# EAGLE design untitledv1.0 (EAGLE 9.6.2)
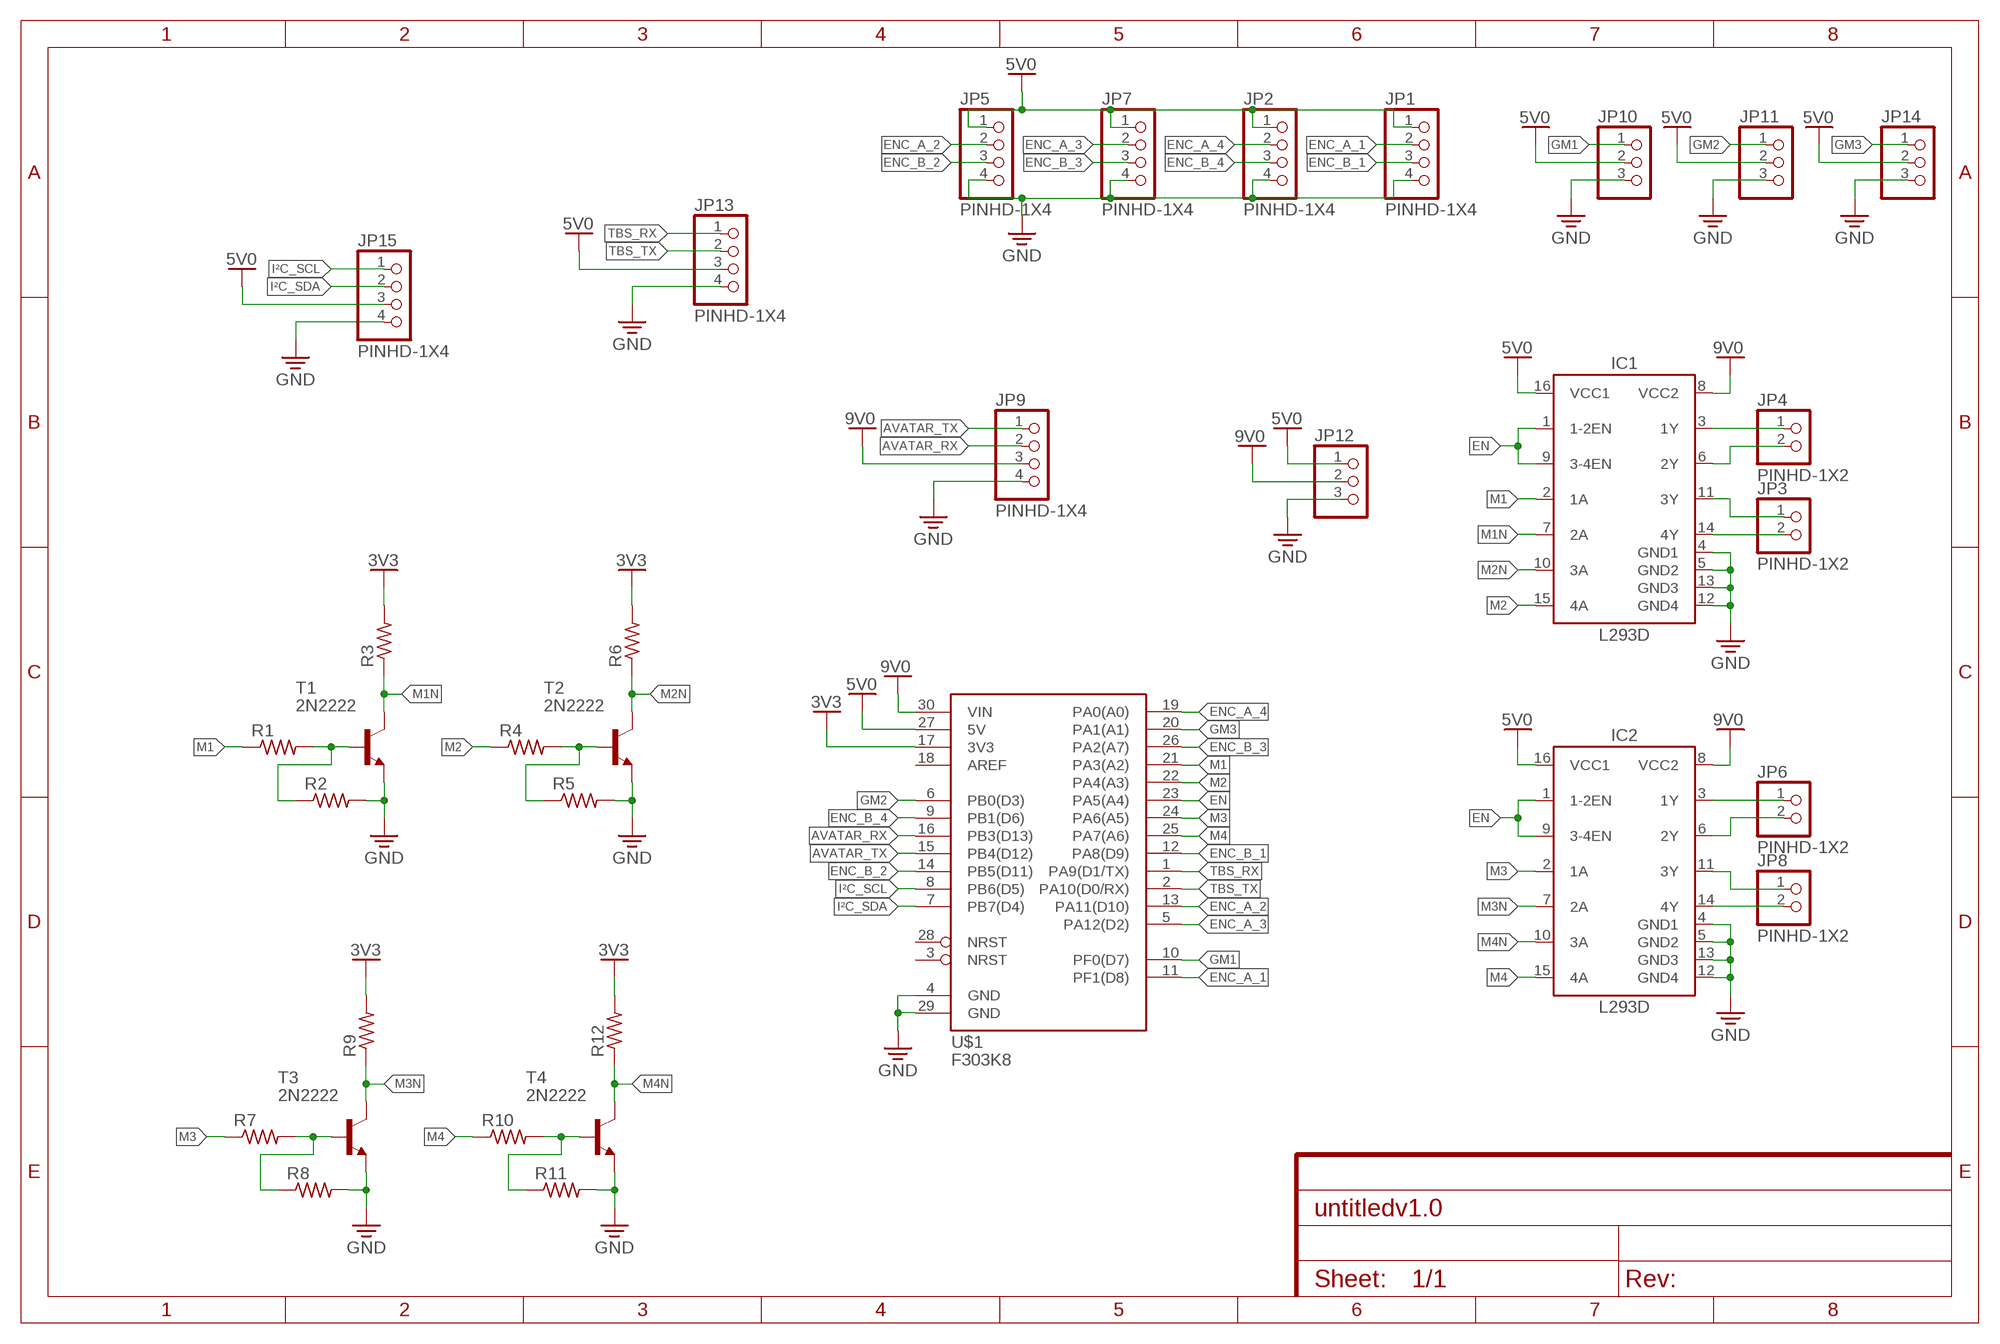
[diagram p0: schematic, sheet 1]

## Parts
IC1  L293D  [DIP762W53P254L1969H508Q16B]
IC2  L293D  [DIP762W53P254L1969H508Q16B]
JP1  PINHD-1X4  [1X04]
JP2  PINHD-1X4  [1X04]
JP3  PINHD-1X2  [1X02]
JP4  PINHD-1X2  [1X02]
JP5  PINHD-1X4  [1X04]
JP6  PINHD-1X2  [1X02]
JP7  PINHD-1X4  [1X04]
JP8  PINHD-1X2  [1X02]
JP9  PINHD-1X4  [1X04]
JP10  PINHD-1X3  [1X03]
JP11  PINHD-1X3  [1X03]
JP12  PINHD-1X3  [1X03]
JP13  PINHD-1X4  [1X04]
JP14  PINHD-1X3  [1X03]
JP15  PINHD-1X4  [1X04]
R1  R-US_0204/2V  [0204V]
R2  R-US_0204/2V  [0204V]
R3  R-US_0204/2V  [0204V]
R4  R-US_0204/2V  [0204V]
R5  R-US_0204/2V  [0204V]
R6  R-US_0204/2V  [0204V]
R7  R-US_0204/2V  [0204V]
R8  R-US_0204/2V  [0204V]
R9  R-US_0204/2V  [0204V]
R10  R-US_0204/2V  [0204V]
R11  R-US_0204/2V  [0204V]
R12  R-US_0204/2V  [0204V]
T1  2N2222  [TO92-EBC-OVAL]
T2  2N2222  [TO92-EBC-OVAL]
T3  2N2222  [TO92-EBC-OVAL]
T4  2N2222  [TO92-EBC-OVAL]
U$1  F303K8  [NUCLEO_F303K8-V2]

## Nets
3V3: R3.2 R6.2 R9.2 R12.2 U$1.17(3V3)
5V0: IC1.16(VCC1) IC2.16(VCC1) JP1.1 JP2.1 JP5.1 JP7.1 JP10.2 JP11.2 JP12.1 JP13.3 JP14.2 JP15.3 U$1.27(5V)
9V0: IC1.8(VCC2) IC2.8(VCC2) JP9.3 JP12.2 U$1.30(VIN)
AVATAR_RX: JP9.2 U$1.16(PB3(D13))
AVATAR_TX: JP9.1 U$1.15(PB4(D12))
EN: IC1.1(1-2EN) IC1.9(3-4EN) IC2.1(1-2EN) IC2.9(3-4EN) U$1.23(PA5(A4))
ENC_A_1: JP1.2 U$1.11(PF1(D8))
ENC_A_2: JP5.2 U$1.13(PA11(D10))
ENC_A_3: JP7.2 U$1.5(PA12(D2))
ENC_A_4: JP2.2 U$1.19(PA0(A0))
ENC_B_1: JP1.3 U$1.12(PA8(D9))
ENC_B_2: JP5.3 U$1.14(PB5(D11))
ENC_B_3: JP7.3 U$1.26(PA2(A7))
ENC_B_4: JP2.3 U$1.9(PB1(D6))
GM1: JP10.1 U$1.10(PF0(D7))
GM2: JP11.1 U$1.6(PB0(D3))
GM3: JP14.1 U$1.20(PA1(A1))
GND: IC1.4(GND1) IC1.5(GND2) IC1.12(GND4) IC1.13(GND3) IC2.4(GND1) IC2.5(GND2) IC2.12(GND4) IC2.13(GND3) JP1.4 JP2.4 JP5.4 JP7.4 JP9.4 JP10.3 JP11.3 JP12.3 JP13.4 JP14.3 JP15.4 R2.2 R5.2 R8.2 R11.2 T1.E T2.E T3.E T4.E U$1.4(GND) U$1.29(GND)
I²C_SCL: JP15.1 U$1.8(PB6(D5))
I²C_SDA: JP15.2 U$1.7(PB7(D4))
M1: IC1.2(1A) R1.1 U$1.21(PA3(A2))
M1N: IC1.7(2A) R3.1 T1.C
M2: IC1.15(4A) R4.1 U$1.22(PA4(A3))
M2N: IC1.10(3A) R6.1 T2.C
M3: IC2.2(1A) R7.1 U$1.24(PA6(A5))
M3N: IC2.7(2A) R9.1 T3.C
M4: IC2.15(4A) R10.1 U$1.25(PA7(A6))
M4N: IC2.10(3A) R12.1 T4.C
N$4: IC1.14(4Y) JP3.2
N$5: IC1.11(3Y) JP3.1
N$6: IC1.6(2Y) JP4.2
N$7: IC1.3(1Y) JP4.1
N$8: IC2.3(1Y) JP6.1
N$9: IC2.6(2Y) JP6.2
N$10: IC2.11(3Y) JP8.1
N$11: IC2.14(4Y) JP8.2
N$14: R1.2 R2.1 T1.B
N$15: R4.2 R5.1 T2.B
N$19: R7.2 R8.1 T3.B
N$22: R10.2 R11.1 T4.B
TBS_RX: JP13.1 U$1.1(PA9(D1/TX))
TBS_TX: JP13.2 U$1.2(PA10(D0/RX))
Unconnected: U$1.3(NRST) U$1.18(AREF) U$1.28(NRST)

## Library data of the parts
IC1 IC2 = IC_Power-Management:L293: L293D H-bridge motor driver Datasheet <https://www.ti.com/lit/ds/symlink/l293.pdf>; CATEGORY: IC_Linear; DESCRIPTION: IC MTRDRV BIPLR 4.5-36V 16PWRDIP; MANUFACTURER: STMicroelectronics; MPN: L293D; OPERATING_TEMP: -40°C ~ 150°C; PART_STATUS: Active; ROHS_COMPLIANT: ROHS3 Compliant; SERIES: L293; SUB-CATEGORY: Motor Driver; TYPE: Bipolar
JP1 JP2 JP5 JP7 JP9 JP13 JP15 = Connector:PINHD-1X4: PIN HEADER; CATEGORY: CONNECTOR; SUB-CATEGORY: PIN-HEADER
JP3 JP4 JP6 JP8 = Connector:PINHD-1X2: PIN HEADER; CATEGORY: CONNECTOR; SUB-CATEGORY: PIN-HEADER
JP10-JP12 JP14 = pinhead:PINHD-1X3: PIN HEADER
R1-R12 = adafruit:R-US_: RESISTOR, American symbol
T1-T4 = adafruit:2N2222: NPN TRANSISTOR Big oval pads
U$1 = nucleo_F303K8:F303K8

## Board
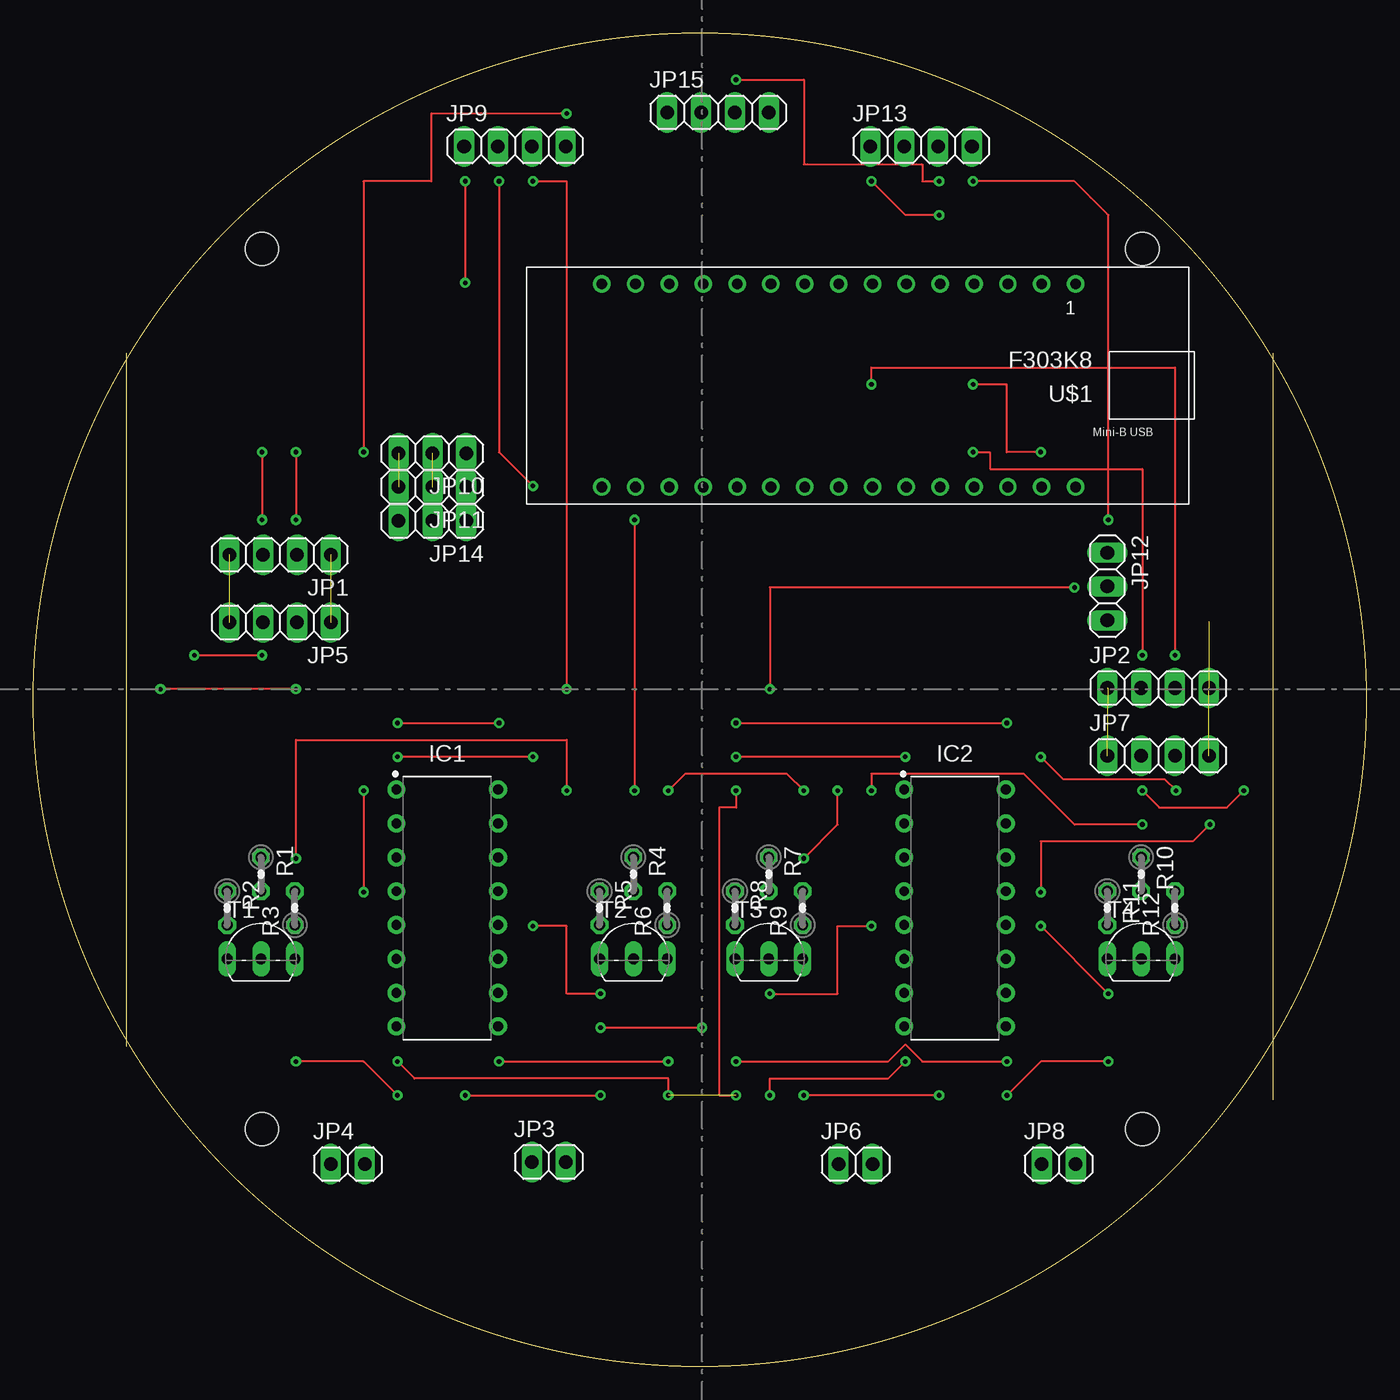
[diagram p1: board, top side]
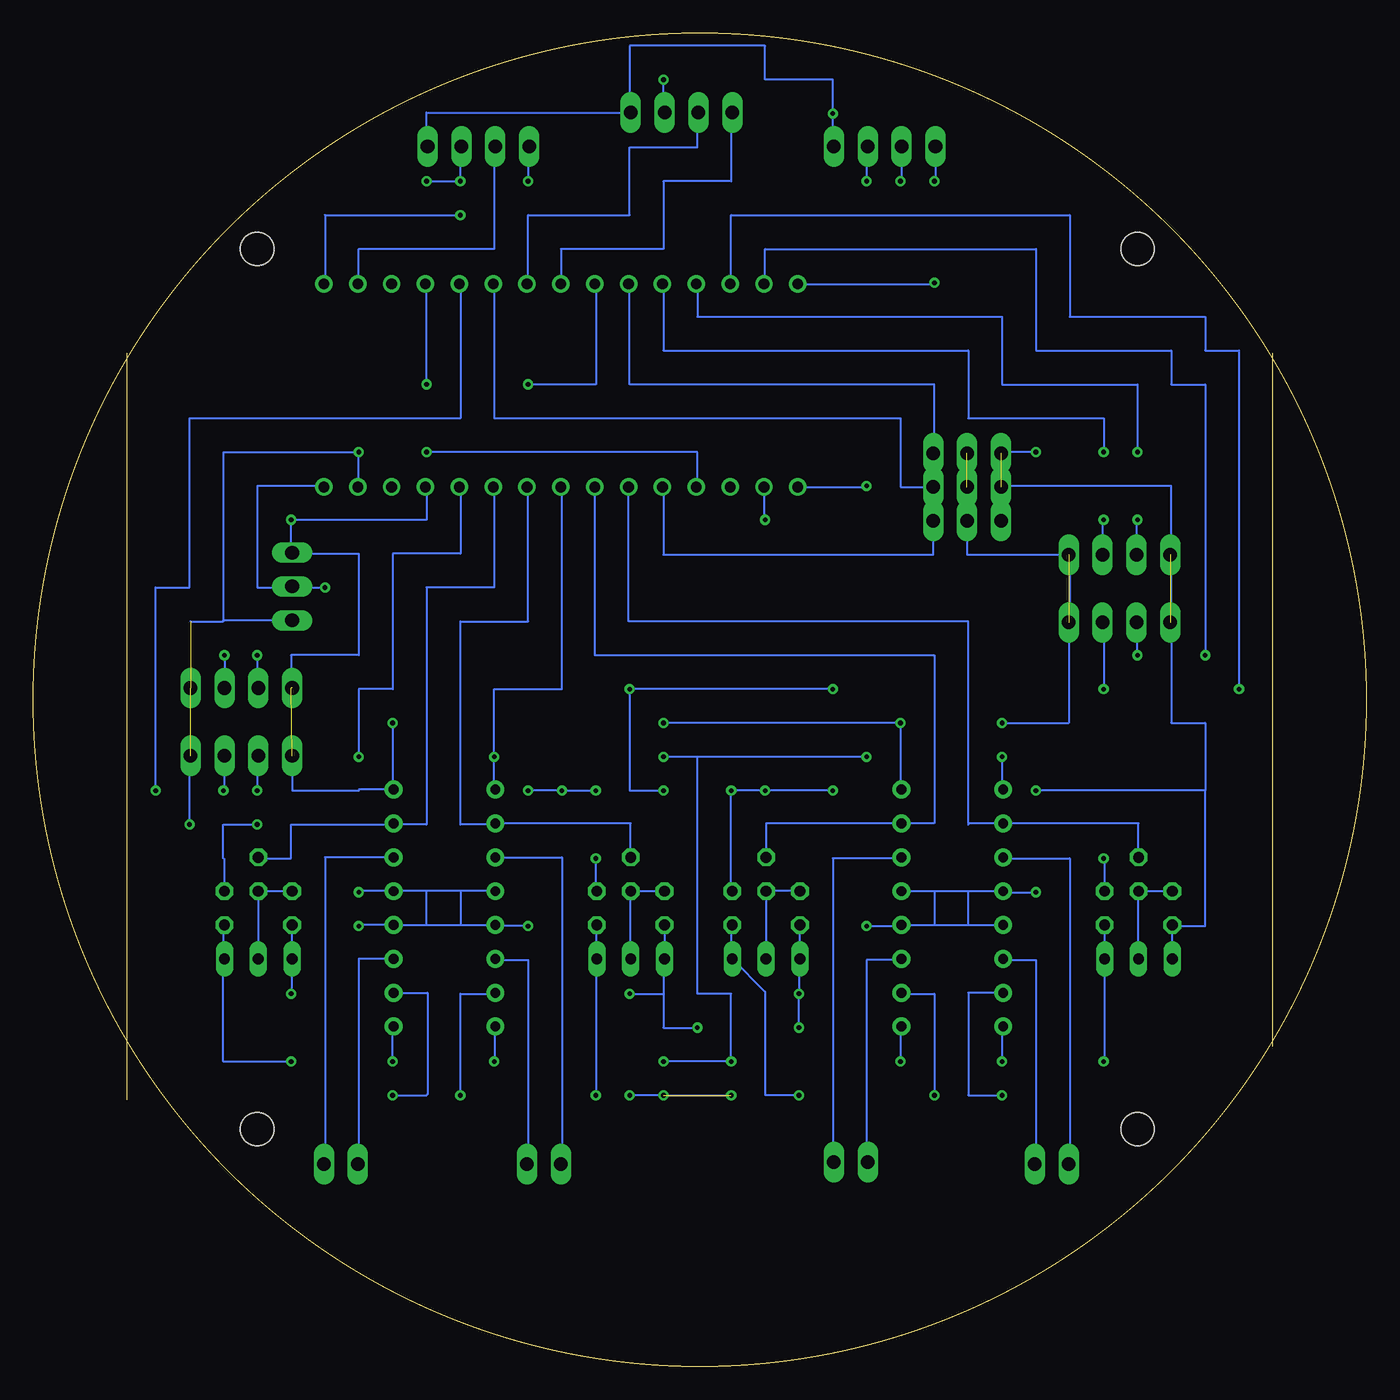
[diagram p2: board, bottom side, seen from below]

Size 100 x 100 mm. Coordinates in mm from the lower left corner, seen from the top.
Outline: 7,24 7,76
Outline: 93,76 93,20
Outline: circle at 50,50 radius 50
Copper layers (1*16): Top 0.035mm / dielectric 1.5mm / Bottom 0.035mm
Design rules "default": minimum track width 6mil, minimum drill 0.35mm, track to track 6mil, track to pad 6mil, pad to pad 6mil, via to via 6mil, smd to smd 6mil, copper to edge 40mil, drill to drill 6mil, minimum pad ring 10mil, minimum via ring 8mil, stop-mask expansion 4mil, vias tented up to drill 0mil, thermal gap 10mil
Holes 2.5 mm at 17.16,17.78 83.2,17.78 83.2,83.82 17.16,83.82

### Footprints (pad centres in the part's own frame; a part is rotated, then mirrored left to right if it is on the bottom)
DIP762W53P254L1969H508Q16B = drill 0.743 pad 1.343: 1 -3.81,8.89; 2 -3.81,6.35; 3 -3.81,3.81; 4 -3.81,1.27; 5 -3.81,-1.27; 6 -3.81,-3.81; 7 -3.81,-6.35; 8 -3.81,-8.89; 9 3.81,-8.89; 10 3.81,-6.35; 11 3.81,-3.81; 12 3.81,-1.27; 13 3.81,1.27; 14 3.81,3.81; 15 3.81,6.35; 16 3.81,8.89
1X04 = drill 1.016 long: 1 -3.81,0; 2 -1.27,0; 3 1.27,0; 4 3.81,0
1X02 = drill 1.016 long: 1 -1.27,0; 2 1.27,0
1X03 = drill 1.016 long: 1 -2.54,0; 2 0,0; 3 2.54,0
0204V = drill 0.813 octagon: 1 -1.27,0; 2 1.27,0
TO92-EBC-OVAL = drill 0.813 long: B 0,-1.27; C 2.54,-1.27; E -2.54,-1.27
NUCLEO_F303K8-V2 = drill 0.8: 1 -15.24,-6.35; 2 -12.7,-6.35; 3 -10.16,-6.35; 4 -7.62,-6.35; 5 -5.08,-6.35; 6 -2.54,-6.35; 7 0,-6.35; 8 2.54,-6.35; 9 5.08,-6.35; 10 7.62,-6.35; 11 10.16,-6.35; 12 12.7,-6.35; 13 15.24,-6.35; 14 17.78,-6.35; 15 20.32,-6.35; 16 20.32,8.89; 17 17.78,8.89; 18 15.24,8.89; 19 12.7,8.89; 20 10.16,8.89; 21 7.62,8.89; 22 5.08,8.89; 23 2.54,8.89; 24 0,8.89; 25 -2.54,8.89; 26 -5.08,8.89; 27 -7.62,8.89; 28 -10.16,8.89; 29 -12.7,8.89; 30 -15.24,8.89

### Placement (x,y rotation side)
IC1  31.05,34.37 0 top
IC2  69.15,34.37 0 top
JP1  18.51,60.88 180 top
JP2  84.39,50.88 0 top
JP3  38.67,15.32 0 top
JP4  23.59,15.16 0 top
JP5  18.51,55.8 180 top
JP6  61.69,15.16 0 top
JP7  84.39,45.8 0 top
JP8  76.93,15.16 0 top
JP9  36.13,91.52 0 top
JP10  29.94,68.5 180 top
JP11  29.94,65.96 180 top
JP12  80.58,58.5 270 top
JP13  66.61,91.52 0 top
JP14  29.94,63.42 180 top
JP15  51.37,94.06 0 top
R1  17.08,36.91 270 top
R2  14.54,34.37 270 top
R3  19.62,34.37 90 top
R4  45.02,36.91 270 top
R5  42.48,34.37 270 top
R6  47.56,34.37 90 top
R7  55.18,36.91 270 top
R8  52.64,34.37 270 top
R9  57.72,34.37 90 top
R10  83.12,36.91 270 top
R11  80.58,34.37 270 top
R12  85.66,34.37 90 top
T1  17.08,31.83 0 top
T2  45.02,31.83 0 top
T3  55.18,31.83 0 top
T4  83.12,31.83 0 top
U$1  62.96,74.85 180 top

### Tracks (layer width: path | path; a pad name or v marks a point on that pad's centre or on a via)
3V3  (via drill 0.35)
  Top 0.152: v57.8,43.18 56.53,44.45 48.91,44.45 v47.64,43.18 | v45.1,63.5 v45.1,43.18 | v19.7,38.1 19.7,46.99 40.02,46.99 v40.02,43.18 | v83.2,40.64 78.12,40.64 74.31,44.45 62.88,44.45 v62.88,43.18 | v57.8,38.1 60.34,40.64 v60.34,43.18
  Bottom 0.152: R9.2 57.8,35.64 v57.8,38.1 | R6.2 47.64,35.64 v47.64,43.18 v45.1,43.18 v40.02,43.18 | U$1.17 45.18,63.58 v45.1,63.5 | R3.2 19.62,38.02 v19.7,38.1 | R12.2 85.66,38.02 85.74,38.1 85.74,40.64 v83.2,40.64 | v57.8,43.18 v60.34,43.18 v62.88,43.18
5V0  (via drill 0.35)  (4 unrouted)
  Top 0.152: v27.32,48.26 v34.94,48.26 | v52.72,48.26 v73.04,48.26 | v52.72,96.52 57.8,96.52 57.8,90.17 66.69,90.17 66.69,88.9 v67.96,88.9 | v80.66,63.5 80.66,86.36 78.12,88.9 v70.5,88.9
  Bottom 0.152: U$1.27 70.5,65.96 70.5,63.5 v80.66,63.5 80.66,61.04 JP12.1 80.58,60.96 75.58,60.96 75.58,53.34 80.66,53.34 80.66,50.88 | IC2.16 73.04,43.26 | 73.04,43.26 75.58,43.26 75.58,43.18 80.58,43.18 JP7.1 | JP10.2 JP14.2 29.94,60.88 22.24,60.88 22.24,55.88 JP5.1 22.32,48.26 v27.32,48.26 | IC1.16 34.94,43.26 v34.94,48.26 v52.72,48.26 | v73.04,48.26 73.04,43.26 | JP15.3 52.72,94.06 v52.72,96.52 | JP13.3 67.96,91.52 v67.96,88.9 v70.5,88.9
9V0  (via drill 0.35)  (1 unrouted)
  Top 0.152: v27.32,22.86 28.59,21.59 47.64,21.59 v47.64,20.32 | v65.42,22.86 64.15,21.59 55.26,21.59 v55.26,20.32 | v78.12,58.42 55.26,58.42 v55.26,50.8 | v52.72,43.18 52.72,41.91 51.45,41.91 51.45,20.32 v52.72,20.32 | v37.48,88.9 40.02,88.9 v40.02,50.8
  Bottom 0.152: U$1.30 78.2,66.04 83.2,66.04 83.2,58.42 80.58,58.42 | IC1.8 27.32,25.48 v27.32,22.86 | v65.42,22.86 65.34,22.94 IC2.8 | JP12.2 80.58,58.42 | 80.58,58.42 v78.12,58.42 | v52.72,43.18 55.26,43.18 v55.26,50.8 v40.02,50.8 | v55.26,20.32 v52.72,20.32 v47.64,20.32 | JP9.3 37.48,91.52 v37.48,88.9
AVATAR_RX  (via drill 0.35)
  Top 0.152: v34.94,88.9 34.94,68.58 v37.48,66.04
  Bottom 0.152: U$1.16 37.48,65.96 v37.48,66.04 | JP9.2 34.86,88.9 v34.94,88.9
AVATAR_TX  (via drill 0.35)
  Top 0.152: v32.4,88.9 v32.4,81.28
  Bottom 0.152: U$1.15 32.4,81.2 v32.4,81.28 | JP9.1 32.32,88.9 v32.4,88.9
EN  (via drill 0.35)
  Top 0.152: v65.42,45.72 v52.72,45.72 | v37.48,45.72 v27.32,45.72 | v34.94,22.86 v47.64,22.86 | v52.72,22.86 64.15,22.86 65.42,24.13 66.69,22.86 v73.04,22.86
  Bottom 0.152: IC2.1 65.42,43.26 v65.42,45.72 65.42,50.8 60.34,50.8 60.34,65.96 U$1.23 | v27.32,45.72 27.32,43.18 27.24,43.18 IC1.1 | IC1.9 34.94,25.48 v34.94,22.86 | v73.04,22.86 73.04,25.48 IC2.9 | v52.72,22.86 v47.64,22.86 47.64,27.94 50.18,27.94 50.18,45.72 | 50.18,45.72 v52.72,45.72 | v37.48,45.72 50.18,45.72
ENC_A_1  (via drill 0.35)
  Top 0.152: v19.7,68.58 v19.7,63.5
  Bottom 0.152: U$1.11 52.72,81.2 52.72,76.2 29.86,76.2 29.86,71.12 19.7,71.12 v19.7,68.58 | v19.7,63.5 19.78,63.5 JP1.2
ENC_A_2  (via drill 0.35)
  Top 0.152: v19.7,50.8 v9.54,50.8
  Bottom 0.152: U$1.13 47.64,81.2 47.64,86.36 22.24,86.36 22.24,78.74 12.08,78.74 12.08,76.2 9.54,76.2 v9.54,50.8 | JP5.2 19.7,55.8 v19.7,50.8
ENC_A_3  (via drill 0.35)
  Top 0.152: v83.2,43.18 84.47,41.91 89.55,41.91 v90.82,43.18
  Bottom 0.152: U$1.5 67.96,81.2 67.96,71.12 88.28,71.12 88.28,58.42 90.82,58.42 v90.82,43.18 | JP7.2 83.2,45.8 v83.2,43.18
ENC_A_4  (via drill 0.35)
  Top 0.152: v83.2,53.34 83.2,67.31 71.77,67.31 71.77,68.58 v70.5,68.58
  Bottom 0.152: U$1.19 50.18,65.96 50.18,68.58 v70.5,68.58 | v83.2,53.34 83.2,50.96 JP2.2
ENC_B_1  (via drill 0.35)
  Top 0.152: v17.16,68.58 v17.16,63.5
  Bottom 0.152: U$1.12 50.18,81.2 50.18,78.74 27.32,78.74 27.32,73.66 17.16,73.66 v17.16,68.58 | v17.16,63.5 17.24,63.5 JP1.3
ENC_B_2  (via drill 0.35)
  Top 0.152: v12.08,53.34 v17.16,53.34
  Bottom 0.152: U$1.14 45.1,81.2 45.1,83.82 24.78,83.82 24.78,76.2 14.62,76.2 14.62,73.66 12.08,73.66 v12.08,53.34 | v17.16,53.34 17.16,55.88 17.24,55.88 JP5.3
ENC_B_3  (via drill 0.35)
  Top 0.152: v85.74,43.18 84.87,44.05 77.25,44.05 v75.58,45.72
  Bottom 0.152: U$1.26 67.96,65.96 67.96,60.96 73.04,60.96 73.04,50.8 75.58,50.8 v75.58,45.72 | 85.66,43.18 v85.74,43.18 85.66,43.26 JP7.3
ENC_B_4  (via drill 0.35)
  Top 0.152: v62.88,73.66 62.88,74.93 85.66,74.93 v85.66,53.34
  Bottom 0.152: U$1.9 57.8,81.2 57.8,73.66 v62.88,73.66 | v85.66,53.34 JP2.3
GM1
  Bottom 0.152: U$1.10 55.26,81.2 55.26,73.66 32.4,73.66 32.4,68.42 32.48,68.42 JP10.1
GM2
  Bottom 0.152: U$1.6 65.42,81.2 65.42,71.12 34.94,71.12 34.94,65.96 JP11.1 32.4,65.96
GM3
  Bottom 0.152: U$1.20 52.72,65.96 52.72,60.88 32.48,60.88 JP14.1
GND  (via drill 0.35)  (4 unrouted)
  Top 0.152: v42.56,27.94 40.02,27.94 40.02,33.02 v37.48,33.02 | v55.26,27.94 60.34,27.94 60.34,33.02 v62.88,33.02 | v50.18,25.4 v42.56,25.4 | v75.58,33.02 v80.66,27.94 | v75.58,68.58 73.04,68.58 73.04,73.66 v70.5,73.66 | v75.58,35.56 75.58,39.37 87.01,39.37 v88.28,40.64 | v24.78,68.58 24.78,88.9 29.86,88.9 29.86,93.98 v40.02,93.98 | v24.78,43.18 v24.78,35.56
  Bottom 0.152: IC2.4 67.96,35.64 | 67.96,35.64 70.5,35.64 | 70.5,33.1 IC2.12 75.5,33.1 v75.58,33.02 | 70.5,33.1 67.96,33.1 | 67.96,33.1 65.42,33.1 | 65.42,33.1 IC2.5 | 67.96,35.64 67.96,33.1 | 70.5,33.1 70.5,35.64 | 32.4,33.1 IC1.12 34.86,33.02 v37.48,33.02 | 32.4,33.1 29.86,33.1 | 29.86,33.1 IC1.5 | 29.86,33.1 29.86,35.64 | R11.2 T4.E 80.58,28.02 v80.66,27.94 | JP12.3 85.74,55.96 | 85.74,55.96 85.74,55.88 88.2,55.88 | U$1.29 75.58,65.96 v75.58,68.58 85.74,68.58 85.74,55.96 | 70.5,35.64 IC2.13 75.58,35.64 v75.58,35.56 | IC1.13 32.4,35.64 | 32.4,35.64 IC1.4 27.24,35.56 v24.78,35.56 | 32.4,35.64 32.4,33.1 | v62.88,33.02 65.42,33.02 65.42,33.1 | R8.2 T3.E 52.72,30.48 52.72,27.94 | R5.2 T2.E 42.56,30.56 v42.56,27.94 v42.56,25.4 | 14.62,55.8 14.62,66.04 27.4,66.04 JP11.3 | JP14.3 27.32,63.42 27.32,68.5 | 27.32,68.58 27.4,68.58 JP10.3 27.32,68.5 | 27.32,68.5 27.32,68.58 | T1.E R2.2 14.54,33.02 12.08,33.02 12.08,43.18 | JP5.4 14.62,55.8 | 12.08,43.18 12.08,48.26 14.62,48.26 14.62,55.8 | JP9.4 40.02,91.52 v40.02,93.98 40.02,96.52 45.1,96.52 45.1,99.06 55.26,99.06 55.26,94.06 | 55.26,94.06 JP15.4 | JP13.4 70.5,91.52 70.5,94.06 55.26,94.06 | v50.18,25.4 52.72,25.4 52.72,27.94 | v70.5,73.66 70.5,81.2 U$1.4 | v88.28,40.64 88.28,45.8 JP7.4 | v24.78,68.58 27.32,68.58 | 12.08,43.18 v24.78,43.18 | v55.26,27.94 52.72,27.94
I²C_SCL
  Bottom 0.152: U$1.8 60.42,83.82 52.72,83.82 52.72,88.9 47.64,88.9 47.64,94.06 JP15.1
I²C_SDA
  Bottom 0.152: U$1.7 62.88,81.2 62.88,86.36 55.26,86.36 55.26,91.44 50.18,91.44 50.18,94.06 JP15.2
M1
  Bottom 0.152: 29.86,40.72 IC1.2 17.08,40.72 R1.1 | 29.86,40.72 29.86,40.64 | U$1.21 55.34,55.88 29.86,55.88 29.86,40.72
M1N  (via drill 0.35)
  Top 0.152: v27.32,20.32 24.78,22.86 v19.7,22.86
  Bottom 0.152: IC1.7 29.86,28.02 29.86,20.32 v27.32,20.32 | v19.7,22.86 19.62,22.86 T1.C R3.1
M2
  Bottom 0.152: U$1.22 57.88,53.34 32.4,53.34 32.4,40.72 IC1.15 45.02,40.72 R4.1
M2N  (via drill 0.35)
  Top 0.152: v32.4,20.32 v42.56,20.32
  Bottom 0.152: IC1.10 34.86,27.94 32.4,27.94 v32.4,20.32 | v42.56,20.32 45.1,20.32 45.1,28.1 T2.C 47.64,30.56 47.64,33.1 R6.1
M3
  Bottom 0.152: R7.1 55.18,40.72 IC2.2 65.42,40.72 65.42,40.64 67.96,40.64 67.96,55.88 62.88,55.88 62.88,66.04 62.96,66.04 U$1.24
M3N  (via drill 0.35)
  Top 0.152: v67.96,20.32 v57.8,20.32
  Bottom 0.152: IC2.7 65.34,27.94 67.96,27.94 v67.96,20.32 | 57.8,30.56 T3.C | R9.1 57.8,33.1 57.8,30.56 | 57.8,30.56 v57.8,20.32
M4
  Bottom 0.152: U$1.25 65.42,65.96 65.42,58.42 70.5,58.42 70.5,40.64 73.04,40.64 | IC2.15 73.04,40.72 73.04,40.64 | 73.04,40.64 80.66,40.64 80.66,38.1 83.04,38.1 R10.1
M4N  (via drill 0.35)
  Top 0.152: v80.66,22.86 75.58,22.86 v73.04,20.32
  Bottom 0.152: R12.1 85.74,33.1 85.74,30.48 | 85.74,30.48 85.66,30.48 T4.C | IC2.10 70.42,28.02 70.42,20.4 70.5,20.32 v73.04,20.32 | v80.66,22.86 85.74,22.86 85.74,30.48
N$4
  Bottom 0.152: IC1.14 34.86,38.1 40.02,38.1 40.02,15.32 JP3.2
N$5
  Bottom 0.152: IC1.11 34.86,30.48 37.48,30.48 37.48,15.32 JP3.1
N$6
  Bottom 0.152: IC1.6 27.24,30.48 24.78,30.48 24.78,15.16 JP4.2
N$7
  Bottom 0.152: IC1.3 27.24,38.1 22.24,38.1 22.24,15.16 JP4.1
N$8
  Bottom 0.152: IC2.3 60.34,38.18 60.34,15.16 JP6.1
N$9
  Bottom 0.152: IC2.6 65.34,30.48 62.88,30.48 62.88,15.16 JP6.2
N$10
  Bottom 0.152: IC2.11 75.58,30.56 75.58,15.16 JP8.1
N$11
  Bottom 0.152: IC2.14 78.12,38.18 78.12,15.16 JP8.2
N$14
  Bottom 0.152: T1.B R1.2 R2.1
N$15
  Bottom 0.152: R5.1 R4.2 T2.B
N$19
  Bottom 0.152: T3.B R7.2 R8.1
N$22
  Bottom 0.152: T4.B R10.2 R11.1
TBS_RX  (via drill 0.35)
  Top 0.152: v67.96,86.36 65.42,86.36 v62.88,88.9
  Bottom 0.152: JP13.1 62.88,91.52 v62.88,88.9 | v67.96,86.36 78.12,86.36 78.12,81.2 U$1.1
TBS_TX
  Bottom 0.152: JP13.2 65.42,91.52 65.42,83.82 75.58,83.82 75.58,81.2 U$1.2